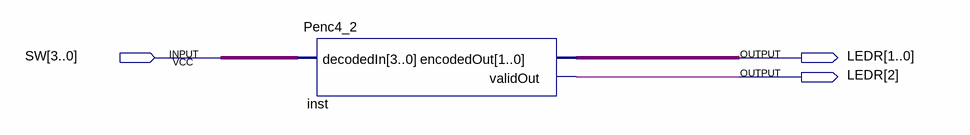
[diagram p0: schematic sheet]
// Quartus schematic PEnc4_2Demo.bdf as structural Verilog: 1 symbols, 3 pins
module PEnc4_2Demo (
  input  [3:0] SW,
  output [2:0] LEDR
);

  Penc4_2 inst (.decodedIn(SW), .encodedOut(LEDR[1:0]), .validOut(LEDR[2]));
endmodule
